# EAGLE design pcb-56dp30a-gain (EAGLE 7.4.0)
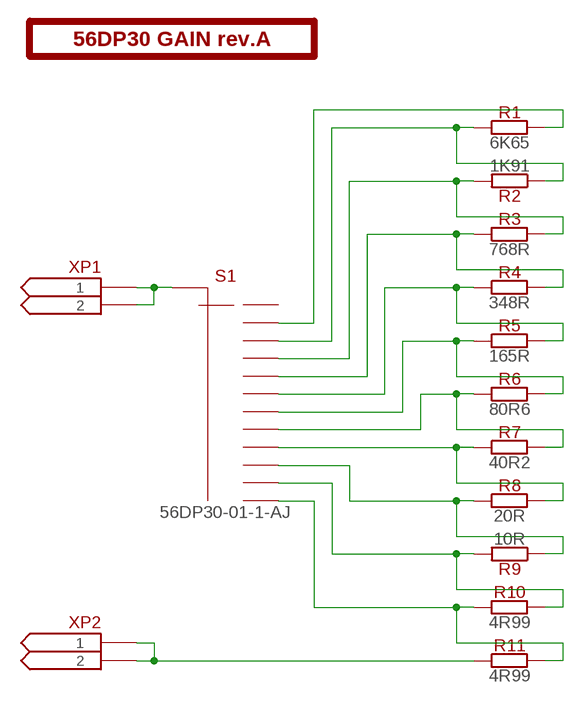
[diagram p0: schematic, sheet 1]

## Parts
PCB1  56DP30 GAIN rev.A  GENERIC-LOGO  [F-LOGO]
R1  6K65  [R-0805]
R2  1K91  [R-0805]
R3  768R  [R-0805]
R4  348R  [R-0805]
R5  165R  [R-0805]
R6  80R6  [R-0805]
R7  40R2  [R-0805]
R8  20R  [R-0805]
R9  10R  [R-0805]
R10  4R99  [R-0805]
R11  4R99  [R-0805]
S1  56DP30-01-1-AJ  [56DP30-01-1]
XP1  CONN-2-NORMAL  [ML2]
XP2  CONN-2-NORMAL  [ML2]

## Nets
N$1: R10.1 R11.2 S1.12
N$2: R9.2 R10.2 S1.11
N$3: R8.1 R9.1 S1.10
N$4: R7.1 R8.2 S1.9
N$5: R6.1 R7.2 S1.8
N$6: R5.1 R6.2 S1.7
N$7: R4.1 R5.2 S1.6
N$8: R3.1 R4.2 S1.5
N$9: R2.2 R3.2 S1.4
N$10: R1.1 R2.1 S1.3
N$11: R11.1 XP2.1 XP2.2
N$14: R1.2 S1.2
N$21: S1.C(CM) XP1.1 XP1.2
Unconnected: S1.1

## Library data of the parts
PCB1 = module-footprints:GENERIC
R1-R7 R10 R11 = resistors:?
R8 = resistors:?; MOUSER: 660-RK73H2ATTD20R0F
R9 = resistors:?; MOUSER: 660-RK73H2ATTD10R0F
S1 = switches:56DP30-01-1-AJ
XP1 XP2 = connectors:CONN-2-?

## Board
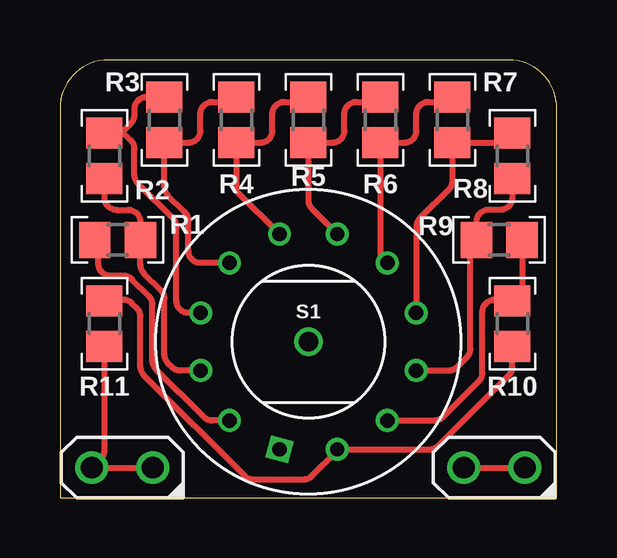
[diagram p1: board, top side]
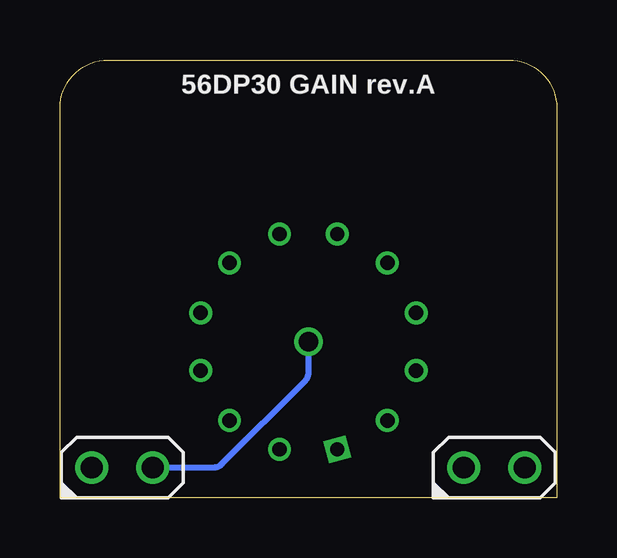
[diagram p2: board, bottom side, seen from below]

Size 20.7 x 18.25 mm. Coordinates in mm from the lower left corner, seen from the top.
Outline: 0,0 20.7,0 20.7,16.25 arc90 18.7,18.25 2,18.25 arc90 0,16.25 0,0
Copper layers (1*16): Top 0.0356mm / dielectric 1.5011mm / Bottom 0.0356mm
Design rules "fluorumlabs": minimum track width 6mil, minimum drill 13mil, track to track 8mil, track to pad 8mil, pad to pad 6mil, via to via 6mil, smd to smd 6mil, copper to edge 15mil, drill to drill 6mil, minimum pad ring 7mil, minimum via ring 7mil, stop-mask expansion 3mil, vias tented up to drill 25mil, thermal gap 10mil

### Footprints (pad centres in the part's own frame; a part is rotated, then mirrored left to right if it is on the bottom)
R-0805 = smd 1.3 x 1.5: 1 -0.95,0; 2 0.95,0
56DP30-01-1 = drill 0.6 square: 1 -1.204,-4.492 | drill 0.6: 2 -3.288,-3.288; 3 -4.492,-1.204; 4 -4.492,1.204; 5 -3.288,3.288; 6 -1.204,4.492; 7 1.204,4.492; 8 3.288,3.288; 9 4.492,1.204; 10 4.492,-1.204; 11 3.288,-3.288; 12 1.204,-4.492 | drill 0.8: C 0,0
ML2 = drill 0.914: 1 0,-1.27; 2 0,1.27

### Placement (x,y rotation side)
PCB1  10.35,17.25 0 bottom
R1  2.4,10.75 180 top
R2  1.85,14.25 90 top
R3  4.35,15.75 90 top
R4  7.35,15.75 90 top
R5  10.35,15.75 90 top
R6  13.35,15.75 90 top
R7  16.35,15.75 90 top
R8  18.85,14.25 90 top
R9  18.3,10.75 0 top
R10  18.85,7.25 90 top
R11  1.85,7.25 90 top
S1  10.35,6.5 0 top
XP1  18.1,1.25 90 top
XP2  2.6,1.25 90 top

### Tracks (layer width: path | path; a pad name or v marks a point on that pad's centre or on a via)
N$1
  Top 0.254: R10.1 18.85,5.46 arc-45 18.7,5.1 15.75,2.15 arc-45 15.4,2.01 S1.12 11.55,1.95 10.5,0.9 arc-45 10.14,0.75 8.06,0.75 arc-45 7.7,0.9 3.5,5.1 arc-45 3.35,5.46 3.35,7.54 arc45 3.2,7.9 3,8.1 arc45 2.64,8.25 1.9,8.25 R11.2
N$2
  Top 0.254: S1.11 15.61,3.21 arc45 15.96,3.36 17.45,4.85 arc45 17.6,5.21 17.6,7.75 arc-90 18.1,8.25 18.8,8.25 R10.2 19.25,8.6 R9.2
N$3
  Top 0.254: S1.10 16.19,5.3 arc45 16.54,5.44 16.95,5.85 arc45 17.1,6.21 17.1,10.5 R9.1 17.35,11.5 arc-90 17.85,12 18.35,12 arc90 18.85,12.5 R8.1
N$4
  Top 0.254: S1.9 14.85,7.71 14.85,11.29 arc-45 15,11.65 16.2,12.85 arc45 16.35,13.21 R7.1 18.45,14.8 R8.2
N$5
  Top 0.254: S1.8 13.5,9.93 arc-45 13.35,10.28 R6.1 14.35,14.8 arc90 14.85,15.3 14.85,16 arc-90 15.35,16.5 16.15,16.5 R7.2
N$6
  Top 0.254: S1.7 10.5,12.05 arc-45 10.35,12.4 R5.1 11.35,14.8 arc90 11.85,15.3 11.85,16 arc-90 12.35,16.5 13.15,16.5 R6.2
N$7
  Top 0.254: S1.6 7.35,12.79 R4.1 8.35,14.8 arc90 8.85,15.3 8.85,16 arc-90 9.35,16.5 10.15,16.5 R5.2
N$8
  Top 0.254: S1.5 5.85,9.79 arc-90 5.35,10.29 5.35,11.54 arc45 5.2,11.9 4.5,12.6 arc-45 4.35,12.96 R3.1 5.35,14.8 arc90 5.85,15.3 5.85,16 arc-90 6.35,16.5 7.15,16.5 R4.2
N$9
  Top 0.254: S1.4 5.35,7.7 arc-90 4.85,8.2 4.85,11.29 arc45 4.7,11.65 3.25,13.1 arc-45 3.1,13.46 3.1,14.54 arc45 2.95,14.9 2.6,15.25 | 2.6,15.25 1.9,15.25 R2.2 | R3.2 3.6,16.7 arc90 3.1,16.2 3.1,15.96 arc-45 2.95,15.6 2.6,15.25
N$10
  Top 0.254: S1.3 5.01,5.3 arc-45 4.66,5.44 4.5,5.6 arc-45 4.35,5.96 4.35,8.29 arc45 4.2,8.65 3.5,9.35 arc-45 3.35,9.71 R1.1 3.35,11.5 arc90 2.85,12 2.35,12 arc-90 1.85,12.5 R2.1
N$11
  Top 0.254: R11.1 1.85,1.98 arc-45 1.7,1.62 XP2.2 XP2.1
N$14
  Top 0.254: S1.2 6.34,3.21 arc-45 5.99,3.36 4,5.35 arc-45 3.85,5.71 3.85,8.04 arc45 3.7,8.4 3,9.1 arc45 2.64,9.25 2.1,9.25 arc-90 1.6,9.75 1.6,10.6 R1.2
N$21
  Top 0.254: XP1.2 XP1.1
  Bottom 0.254: S1.C 10.35,5.21 arc45 10.5,4.85 13.95,1.4 arc45 14.31,1.25 XP1.2